# EAGLE design untitled (EAGLE 9.6.2)
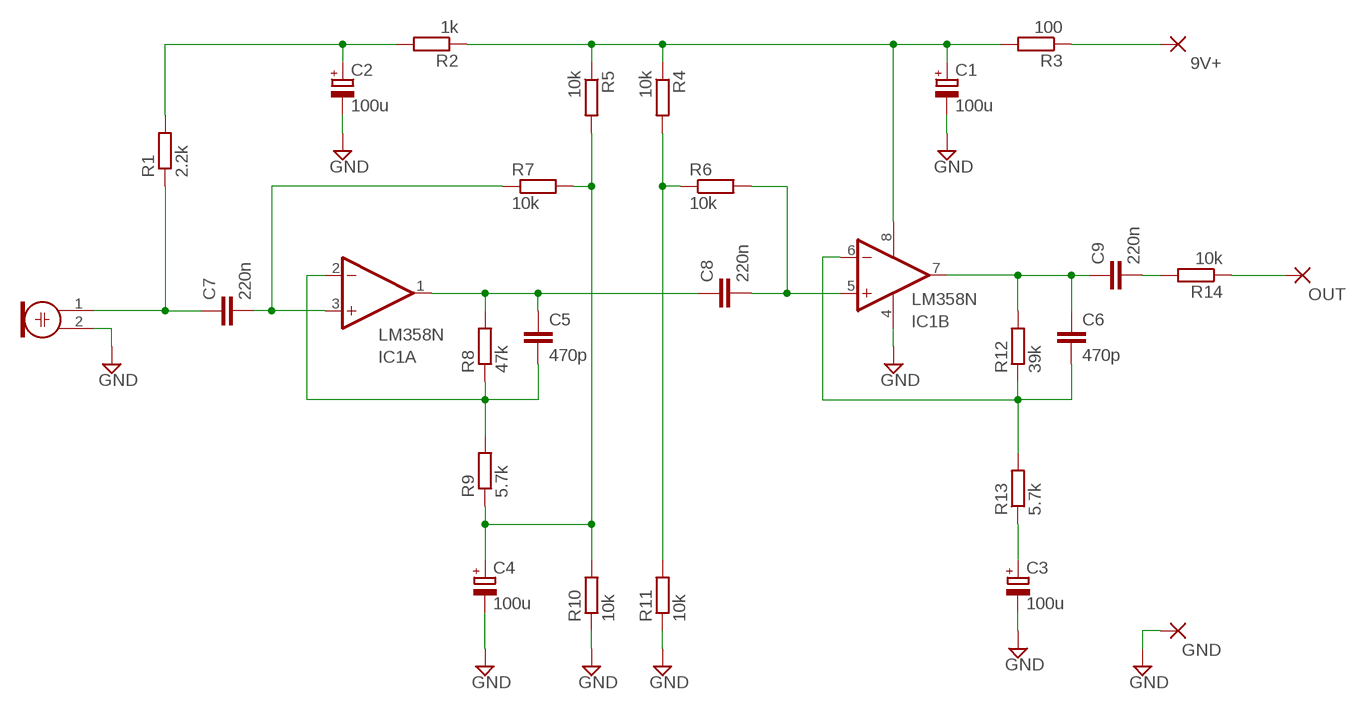
[diagram p0: schematic, sheet 1]

## Parts
9V+  3,81/1,4  [3,81/1,4]
C1  100u  CPOL-EUE2-5  [E2-5]
C2  100u  CPOL-EUE2-5  [E2-5]
C3  100u  CPOL-EUE2-5  [E2-5]
C4  100u  CPOL-EUE2-5  [E2-5]
C5  470p  C-EU025-025X050  [C025-025X050]
C6  470p  C-EU025-025X050  [C025-025X050]
C7  220n  C-EU050-025X075  [C050-025X075]
C8  220n  C-EU050-025X075  [C050-025X075]
C9  220n  C-EU050-025X075  [C050-025X075]
GND  3,81/1,4  [3,81/1,4]
IC1  LM358N  [DIL08]
M1  ELECTRET_MICROPHON-F6050AP  [F6050AP]
OUT  3,81/1,4  [3,81/1,4]
R1  2.2k  R-EU_0207/10  [0207/10]
R2  1k  R-EU_0207/10  [0207/10]
R3  100  R-EU_0207/10  [0207/10]
R4  10k  R-EU_0207/10  [0207/10]
R5  10k  R-EU_0207/10  [0207/10]
R6  10k  R-EU_0207/10  [0207/10]
R7  10k  R-EU_0207/10  [0207/10]
R8  47k  R-EU_0207/10  [0207/10]
R9  5.7k  R-EU_0207/10  [0207/10]
R10  10k  R-EU_0207/10  [0207/10]
R11  10k  R-EU_0207/10  [0207/10]
R12  39k  R-EU_0207/10  [0207/10]
R13  5.7k  R-EU_0207/10  [0207/10]
R14  10k  R-EU_0207/10  [0207/10]

## Nets
GND: C1.- C2.- C3.- C4.- GND.1(P) IC1.4(P:V-) M1.2 R10.1 R11.1
N$1: C7.2 IC1.3(A:+IN) R7.1
N$2: C5.1 C8.1 IC1.1(A:OUT) R8.2
N$3: C5.2 IC1.2(A:-IN) R8.1 R9.2
N$4: C4.+ R5.2 R7.2 R9.1 R10.2
N$5: C8.2 IC1.5(B:+IN) R6.2
N$6: R4.2 R6.1 R11.2
N$7: C7.1 M1.1 R1.1
N$8: C2.+ R1.2 R2.2
N$9: C1.+ IC1.8(P:V+) R2.1 R3.2 R4.1 R5.1
N$10: 9V+.1(P) R3.1
N$11: C6.2 IC1.6(B:-IN) R12.1 R13.2
N$12: C3.+ R13.1
N$13: C6.1 C9.1 IC1.7(B:OUT) R12.2
N$14: OUT.1(P) R14.1
N$15: C9.2 R14.2

## Library data of the parts
9V+ GND OUT = wirepad:3,81/1,4: THROUGH-HOLE PAD
C1-C4 = rcl:CPOL-EU: POLARIZED CAPACITOR, European symbol; SPICEPREFIX: C
C5-C9 = rcl:C-EU: CAPACITOR, European symbol; SPICEPREFIX: C
IC1 = linear:LM358: OP AMP also LM158; LM258; LM2904 Source: http://cache.national.com/ds/LM/LM158.pdf
M1 = microphon:ELECTRET_MICROPHON-: Electret Condenser Microphone
R1-R14 = rcl:R-EU_: RESISTOR, European symbol; SPICEPREFIX: R

## Board
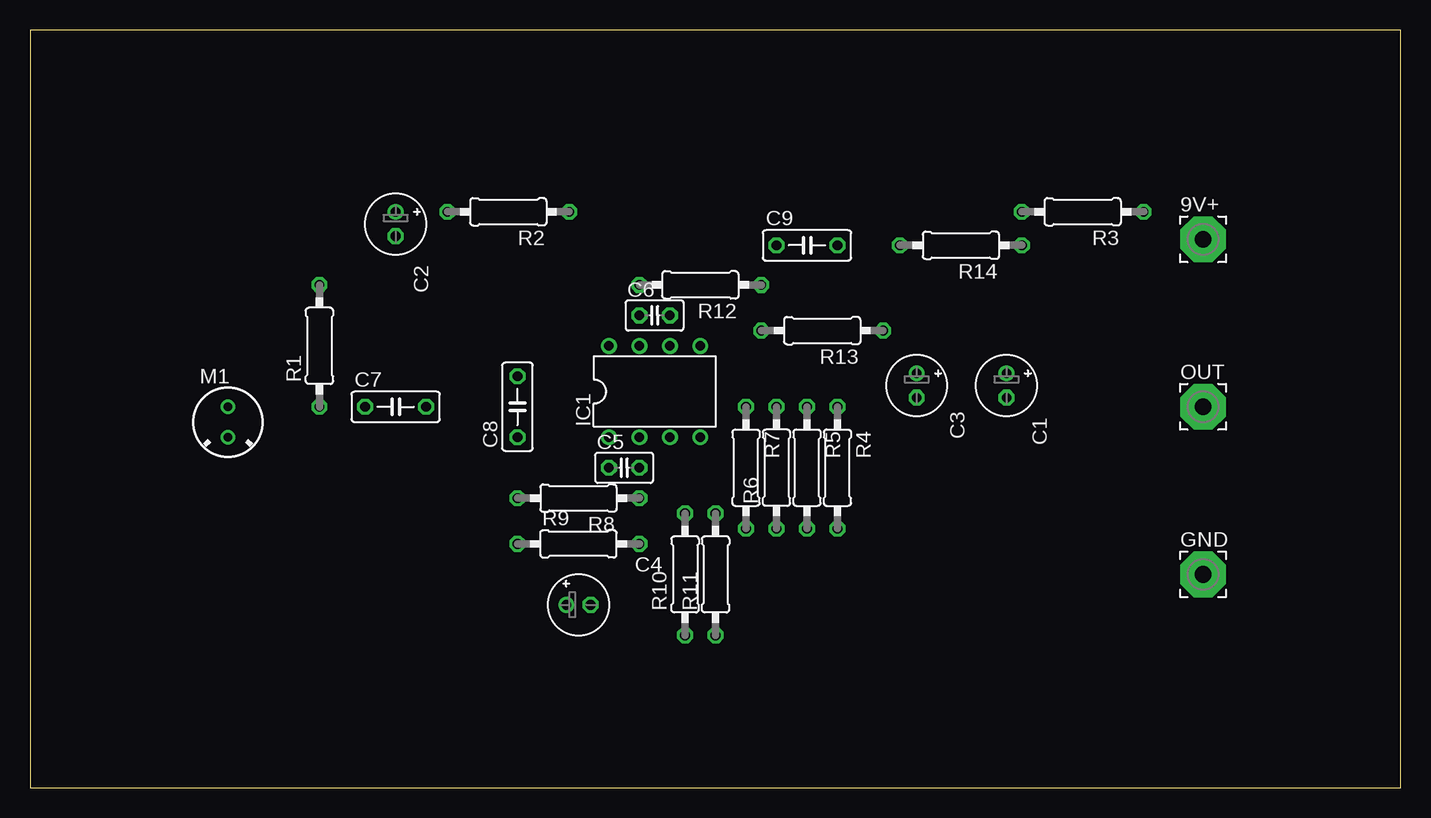
[diagram p1: board, top side]
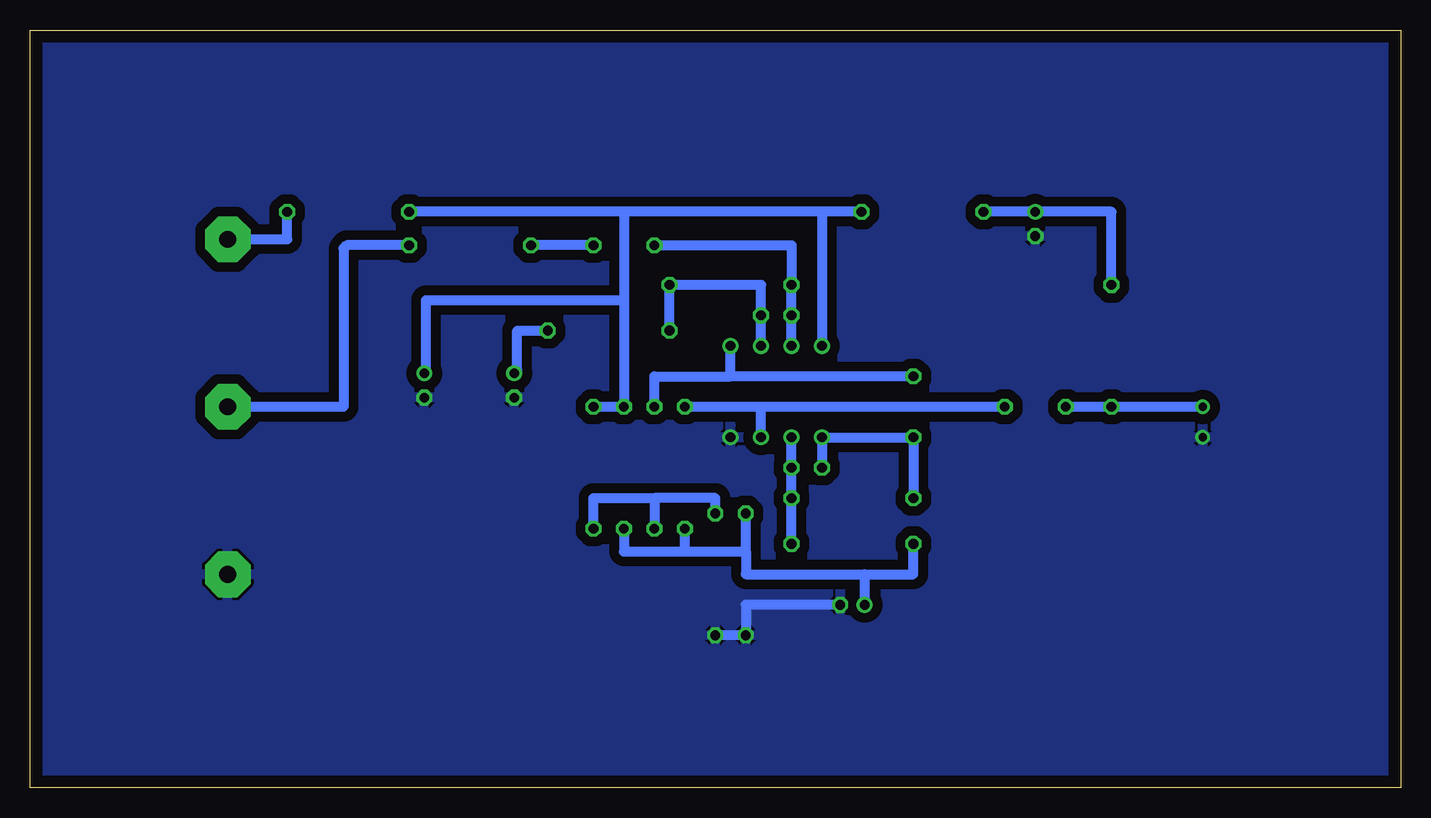
[diagram p2: board, bottom side, seen from below]

Size 114.28 x 63.17 mm. Coordinates in mm from the lower left corner, seen from the top.
Outline: 0,0 114.28,0 114.28,63.17 0,63.17 0,0
Copper layers (1*16): Top 0.035mm / dielectric 1.5mm / Bottom 0.035mm
Design rules "default *": minimum track width 6mil, minimum drill 0.35mm, track to track 6mil, track to pad 6mil, pad to pad 6mil, via to via 6mil, smd to smd 6mil, copper to edge 40mil, drill to drill 6mil, minimum pad ring 10mil, minimum via ring 8mil, stop-mask expansion 4mil, vias tented up to drill 0mil, thermal gap 10mil

### Footprints (pad centres in the part's own frame; a part is rotated, then mirrored left to right if it is on the bottom)
3,81/1,4 = drill 1.397 pad 3.81 octagon: 1 0,0
E2-5 = drill 0.813 pad 1.27: + -1.016,0 | drill 0.813 pad 1.27 octagon: - 1.016,0
C025-025X050 = drill 0.813 octagon: 1 -1.27,0; 2 1.27,0
C050-025X075 = drill 0.813 octagon: 1 -2.54,0; 2 2.54,0
DIL08 = drill 0.813 pad 1.27: 1 -3.81,-3.81; 2 -1.27,-3.81; 3 1.27,-3.81; 4 3.81,-3.81; 5 3.81,3.81; 6 1.27,3.81; 7 -1.27,3.81; 8 -3.81,3.81
F6050AP = drill 0.7 pad 1.2: 1 0,1.27; 2 0,-1.27
0207/10 = drill 0.813 octagon: 1 -5.08,0; 2 5.08,0

### Placement (x,y rotation side)
9V+  97.79,45.72 0 top
C1  81.41,33.53 270 top
C2  30.48,46.99 270 top
C3  73.91,33.53 270 top
C4  45.72,15.24 0 top
C5  49.53,26.67 0 top
C6  52.07,39.37 0 top
C7  30.48,31.75 0 top
C8  40.64,31.75 90 top
C9  64.77,45.21 0 top
GND  97.79,17.78 0 top
IC1  52.07,33.02 0 top
M1  16.51,30.48 0 top
OUT  97.79,31.75 0 top
R1  24.13,36.83 90 top
R2  39.88,48.01 180 top
R3  87.76,48.01 180 top
R4  67.31,26.67 270 top
R5  64.77,26.67 270 top
R6  62.23,26.67 90 top
R7  59.69,26.67 270 top
R8  45.72,24.13 180 top
R9  45.72,20.32 0 top
R10  54.61,17.78 90 top
R11  57.15,17.78 90 top
R12  55.88,41.91 180 top
R13  66.04,38.1 180 top
R14  77.6,45.21 180 top

### Tracks (layer width: path | path; a pad name or v marks a point on that pad's centre or on a via)
GND
  Bottom 0.813: C4.- 54.61,15.24 R10.1 R11.1
  pour Bottom (isolate 0.813): -3.81,66.04 116.84,66.04 116.84,-3.81 -3.81,-3.81
N$1
  Bottom 0.813: C7.2 53.34,31.75 | IC1.3 53.34,31.75 | 53.34,31.75 R7.1
N$2
  Bottom 0.813: R8.2 C8.1 IC1.1 C5.1
N$3
  Bottom 0.813: IC1.2 C5.2 R8.1 R9.2
N$4
  Bottom 0.813: R5.2 64.77,19.69 59.69,19.69 | 59.69,19.69 R7.2 | 59.69,19.69 54.61,19.69 | 54.61,19.69 R10.2 | 54.61,19.69 54.61,17.78 44.7,17.78 | 44.7,17.78 C4.+ | 44.7,17.78 40.64,17.78 R9.1
N$5
  Bottom 0.813: C8.2 55.88,34.29 | 55.88,34.29 IC1.5 | R6.2 62.23,34.29 55.88,34.29
N$6
  Bottom 0.813: R4.2 67.31,24.13 62.23,24.13 | 62.23,24.13 R6.1 | R11.2 57.15,24.13 62.23,24.13
N$7
  Bottom 0.813: M1.1 R1.1 C7.1
N$8
  Bottom 0.813: R1.2 24.13,48.01 C2.+ R2.2
N$9
  Bottom 0.813: R2.1 48.26,48.01 | 48.26,48.01 IC1.8 | 48.26,48.01 64.77,48.01 | 64.77,48.01 64.77,40.64 | 64.77,40.64 R5.1 R4.1 | C1.+ 81.28,34.67 81.28,40.64 64.77,40.64 | 64.77,48.01 82.55,48.01 R3.2 82.8,48.01
N$10
  Bottom 0.813: 9V+.1 92.84,45.72 R3.1
N$11
  Bottom 0.813: IC1.6 C6.2 53.34,41.91 R12.1 R13.2
N$12
  Bottom 0.813: C3.+ 73.66,34.8 73.66,38.1 R13.1
N$13
  Bottom 0.813: IC1.7 C6.1 R12.2 50.8,45.21 C9.1
N$14
  Bottom 0.813: R14.1 87.88,45.21 88.14,44.96 88.14,31.75 OUT.1
N$15
  Bottom 0.813: C9.2 R14.2